# Altium schematic sheet MainSheet.SchDoc
size A3; SheetNumber: 1; SheetTotal: 1
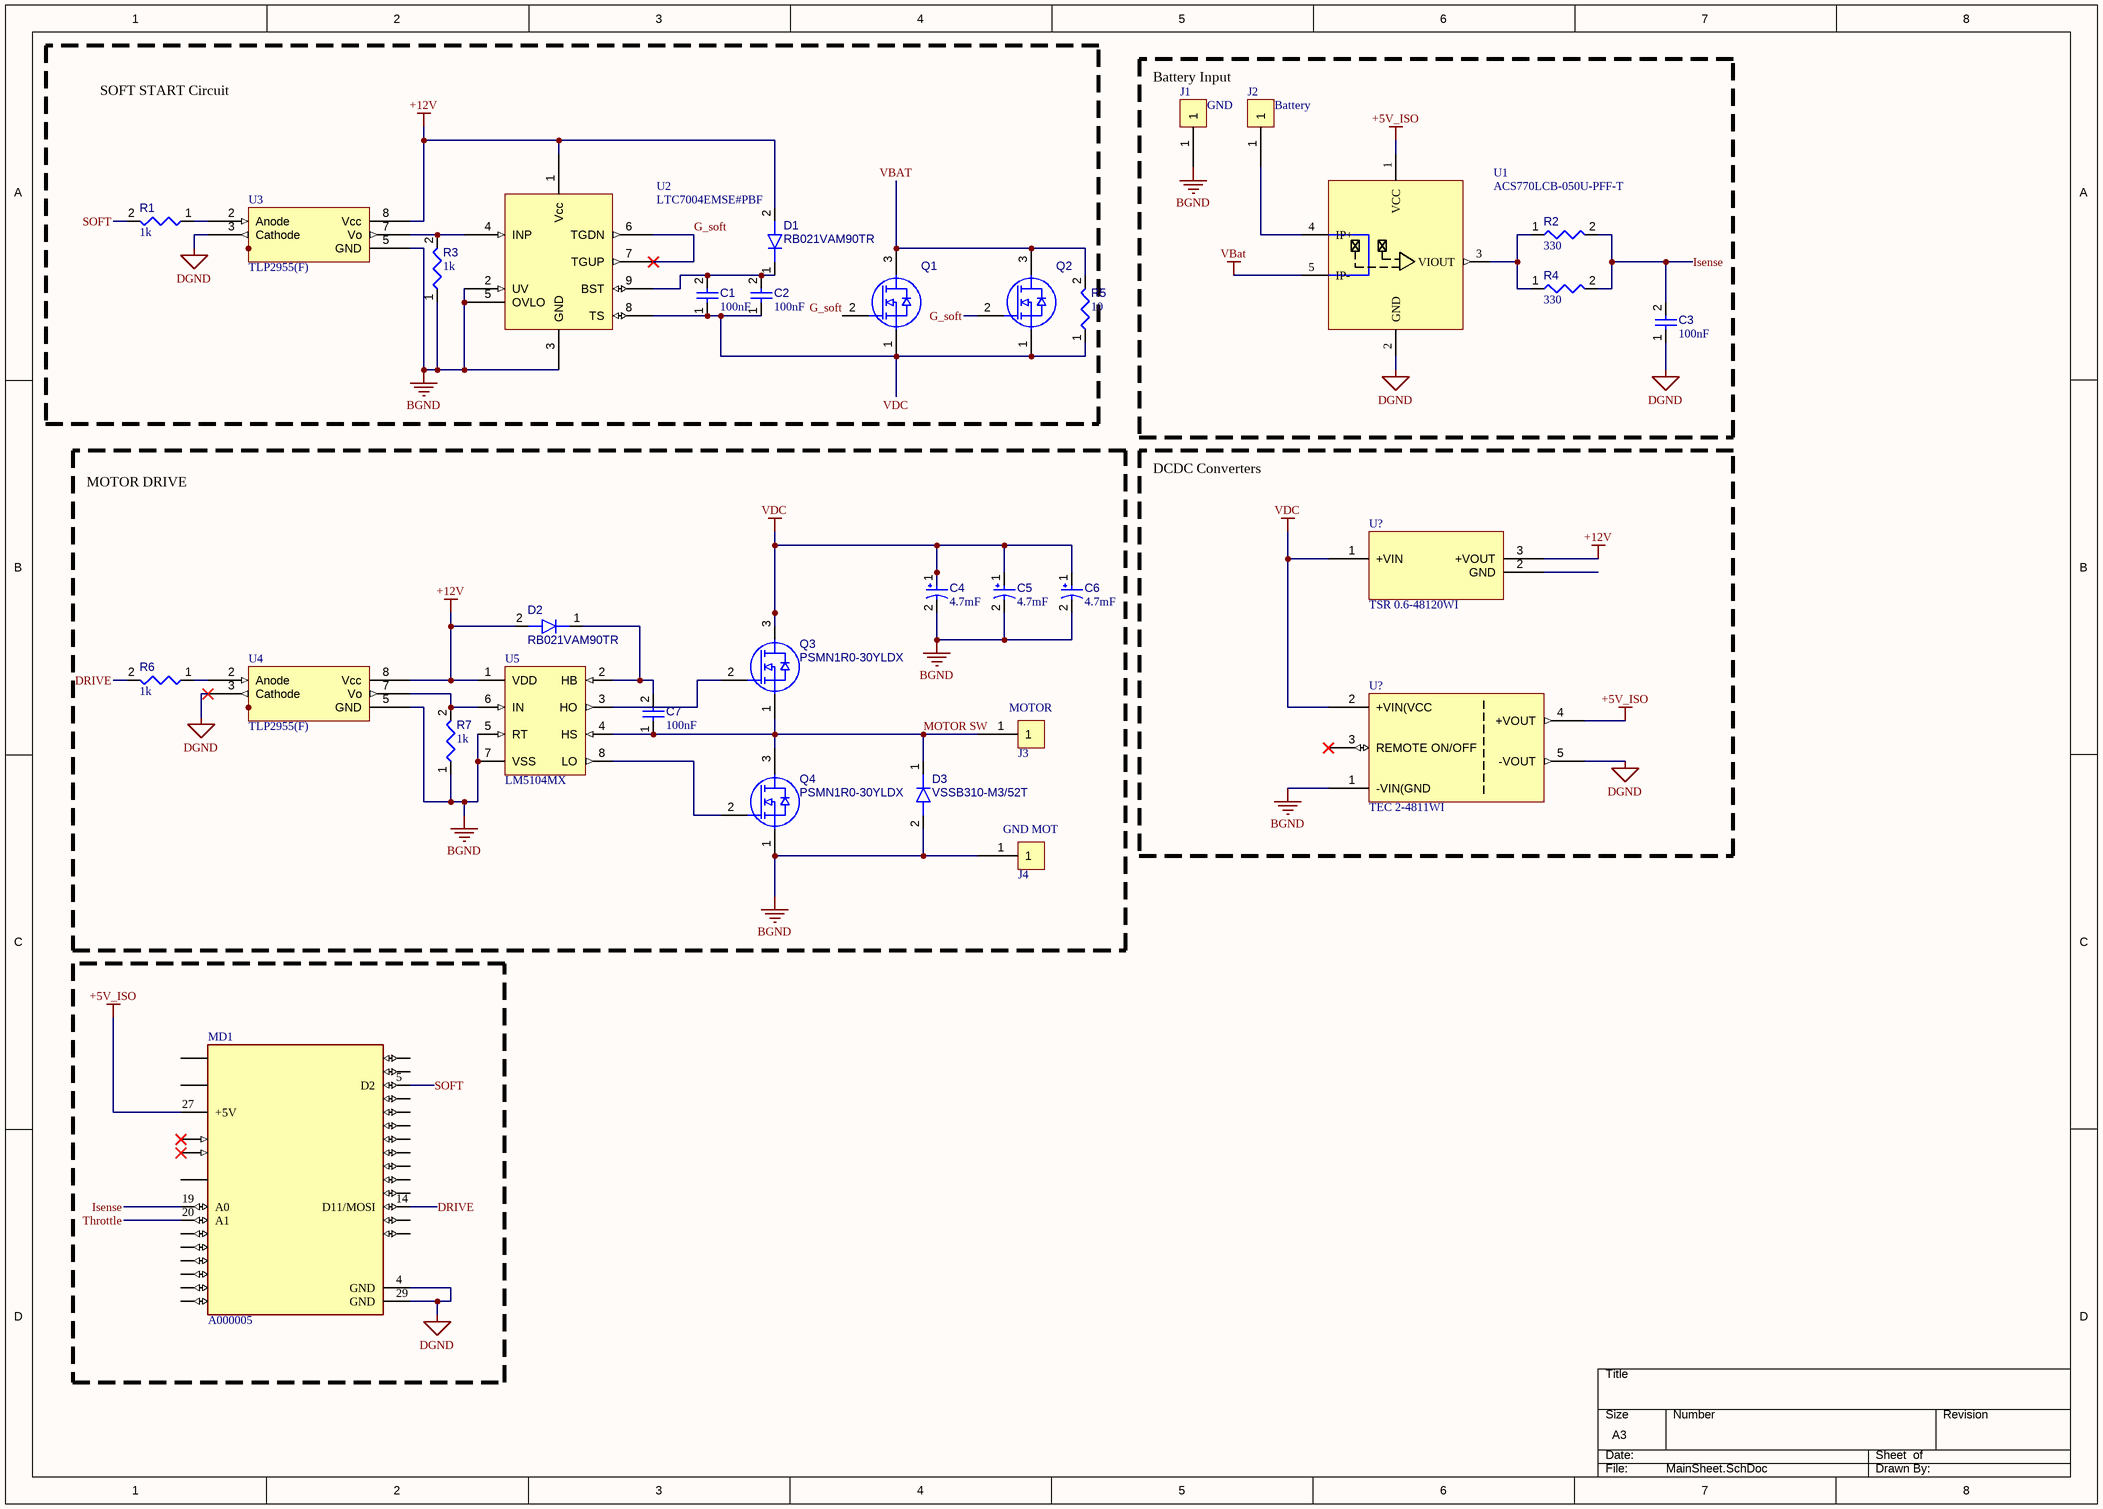
[diagram p0: MainSheet.SchDoc]

## Parts
(Parts that share a designator on the sheet are numbered #1, #2 ... from top to bottom, then left to right.)
C1  value 100nF  [CAPC3216X06N]  (hidden comment: C1206C104K1RACTU)
C2  value 100nF  [CAPC3216X06N]  (hidden comment: C1206C104K1RACTU)
C3  value 100nF  [CAPC3216X06N]  (hidden comment: C1206C104K1RACTU)
C4  value 4.7mF  [UVR1J472MRD-Footprint-1]  (hidden comment: UVR1J472MRD)
C5  value 4.7mF  [UVR1J472MRD-Footprint-1]  (hidden comment: UVR1J472MRD)
C6  value 4.7mF  [UVR1J472MRD-Footprint-1]  (hidden comment: UVR1J472MRD)
C7  value 100nF  [CAPC3216X06N]  (hidden comment: C1206C104K1RACTU)
D1  RB021VAM90TR  [DIOM2014X08N]
D2  RB021VAM90TR  [DIOM2014X08N]
D3  VSSB310-M3/52T  [DIOM4336X24N]
J1  GND  [Solder Pad]
J2  Battery  [Solder Pad]
J3  MOTOR  [Solder Pad]
J4  GND MOT  [Solder Pad]
MD1  A000005  [FP-A000005-MFG]
Q1  IPB014N06NATMA1  [INF-PG-TO263-7-1_M]  (value not drawn)
Q2  IPB014N06NATMA1  [INF-PG-TO263-7-1_M]  (value not drawn)
Q3  PSMN1R0-30YLDX  [NXP-SOT669_L]
Q4  PSMN1R0-30YLDX  [NXP-SOT669_L]
R1  value 1k  [RESC3215X06N]  (hidden comment: CRGP1206F1K0)
R2  value 330  [FP-CRGP1206-IPC_C]  (hidden comment: CRGP1206F330R)
R3  value 1k  [RESC3215X06N]  (hidden comment: CRGP1206F1K0)
R4  value 330  [FP-CRGP1206-IPC_C]  (hidden comment: CRGP1206F330R)
R5  value 10  [RS2B-10 OHM-5%-Footprint-1]  (hidden comment: RS2B-10 OHM-5%)
R6  value 1k  [RESC3215X06N]  (hidden comment: CRGP1206F1K0)
R7  value 1k  [RESC3215X06N]  (hidden comment: CRGP1206F1K0)
U1  ACS770LCB-050U-PFF-T  [FP-CB-5-PFF-MFG]
U2  LTC7004EMSE#PBF  [TSSOP50P490X110_HS-11N]
U3  TLP2955(F)  [SOJ254P890X365-8M]
U4  TLP2955(F)  [SOJ254P890X365-8M]
U5  LM5104MX  [M08A_N]
U?#1  TSR 0.6-48120WI  [TSR0P6-WI_TRP]
U?#2  TEC 2-4811WI  [TEC2_TRP]

## Blocks framed on the sheet
SOFT START Circuit: C1 C2 D1 Q1 Q2 R1 R3 R5 U2 U3
Battery Input: C3 J1 J2 R2 R4 U1
MOTOR DRIVE: C4-C7 D2 D3 J3 J4 Q3 Q4 R6 R7 U4 U5
DCDC Converters: U?#1 U?#2

## Nets
+5V_ISO: MD1.27(+5V) U1.1(VCC) U?#2.4(+VOUT)
+12V: D1.2(A) D2.2(A) U2.1(Vcc) U3.8(Vcc) U4.8(Vcc) U5.1(VDD) U?#1.3(+VOUT)
BGND: C4.2 C5.2 C6.2 D3.2(A) J1.1 J4.1 Q4.1(S) R3.1 R7.1 U2.2(UV) U2.3(GND) U2.5(OVLO) U3.5(GND) U4.5(GND) U5.5(RT) U5.7(VSS) U?#2.1(-VIN(GND)
DGND: C3.1 MD1.4(GND) MD1.29(GND) U1.2(GND) U3.3(Cathode) U4.3(Cathode) U?#2.5(-VOUT)
VBAT: Q1.3(D) Q2.3(D) R5.2 U1.5(IP-)
VDC: C1.1 C2.1 C4.1 C5.1 C6.1 Q1.1(S) Q2.1(S) Q3.3(D) R5.1 U2.8(TS) U?#1.1(+VIN) U?#2.2(+VIN(VCC)
DRIVE: MD1.14(D11/MOSI) R6.2
G_soft: Q2.2(G) U2.6(TGDN) U2.7(TGUP)
Isense: C3.2 MD1.19(A0) R2.2 R4.2
MOTOR SW: C7.1 D3.1(K) J3.1 Q3.1(S) Q4.3(D) U5.4(HS)
SOFT: MD1.5(D2) R1.2
Throttle: MD1.20(A1)
NetC1_2: C1.2 C2.2 D1.1(K) U2.9(BST)
NetC7_2: C7.2 D2.1(K) U5.2(HB)
NetJ2_1: J2.1 U1.4(IP+)
NetQ3_2: Q3.2(G) U5.3(HO)
NetQ4_2: Q4.2(G) U5.8(LO)
NetR1_1: R1.1 U3.2(Anode)
NetR2_1: R2.1 R4.1 U1.3(VIOUT)
NetR3_2: R3.2 U2.4(INP) U3.7(Vo)
NetR6_1: R6.1 U4.2(Anode)
NetR7_2: R7.2 U4.7(Vo) U5.6(IN)
NetU3_1: U3.1(NC) U3.4(NC) U3.6(NC)
NetU4_1: U4.1(NC) U4.4(NC) U4.6(NC)

Not connected (* = marked no-connect by the designer): MD1 1(D1/TX) 2(D0/RX) 3(~{RESET})* 6(D3) 7(D4) 8(D5) 9(D6) 10(D7) 11(D8) 12(D9) 13(D10) 15(D12/MISO) 16(D13/SCK) 17(+3V3) 18(AREF) 21(A2) 22(A3) 23(A4) 24(A5) 25(A6) 26(A7) 28(~{RESET})* 30(VIN); Q1 2(G); U?#1 2(GND); U?#2 3(REMOTE_ON/OFF)*

## Notes on the sheet
- Labels drawn without touching a wire or pin: G_soft
- THIS DOCUMENT AND THE DATA DISCLOSED HEREIN OR
- HEREWITH IS THE PROPERTY OF ALTIUM LIMITED AND MAY
- DWG NO:
- REVISION
- REV:
- DESCRIPTION
- DATE
- APPROVED
- BE FREELY DISTRIBUTED IN WHOLE. NO RIGHTS ARE
- RESERVED OR EXPRESS OR IMPLIED WARANTEE GIVEN.
- ENG:
- APPROVALS
- PROJECT
- DSN:
- CHK:
- REFERENCE DOCUMENTS
- PROJECT REVISION:
- TITLE
- DOCUMENT REVISION:
- DESIGN ITEM:
- BOM:
- FAB DWG:
- PCB DWG:
- ASSY DWG:
- SCALE:
- A3
- SIZE
- CAGE CODE
- FILE NAME
- DWG NO.
- SHEET
- OF
- REV

## Library data of the parts
C1-C3 C7 = CMP-001-00083-1: Ceramic Capacitor, Multilayer, Ceramic, 200V, 10% +Tol, 10% -Tol, X7R, 15% TC, 0.01uF, 1206; Voltage Rating: 100V; Case/Package: 1206; Pins: 2; Mounting Technology: Surface Mount; Min Operating Temperature: -55°C; Max Operating Temperature: 125°C; Tolerance: 10%
C4-C6 = CMP-001-00084-3: Radial Can ALUMINUM ELECTROLYTIC CAPACITOR UVR 63V 4700muF ±20% 0.866Dia 22.00mm; Ripple Current: 3.2A; Pins: 2; Mounting Technology: Through Hole; Tolerance: 20%; Case/Package: Radial; Max Operating Temperature: 85°C; Voltage Rating: 63V; Min Operating Temperature: -40°C
D1 D2 = CMP-004-00031-1: Rectifier Diode, Schottky, 1 Phase, 1 Element, 0.2A, 90V V(RRM), Silicon; Forward Current: 200mA; Mounting Technology: Surface Mount; Max Operating Temperature: 125°C
D3 = CMP-004-00032-1: Rectifier Diode, Schottky, 1 Phase, 1 Element, 1.9A, 100V V(RRM), Silicon, DO-214AA; Forward Voltage: 700mV; Max Operating Temperature: 150°C; Mounting Technology: Surface Mount; Min Operating Temperature: -40°C
J1-J4 = CMP-002-00071-1: Solder Pad for soldering wires to the board
MD1 = CMP-020-00023-1: ATmega328 Microcontroller Development Board 16MHz CPU 2KB RAM 1KB/32KB EEPROM/Flash; Min Supply Voltage: 7V; Interface: I2C, SPI, USB; Max Supply Voltage: 12V; Frequency: 16MHz
Q1 Q2 = CMP-00000-4: Power MOSFET, N Channel, 60 V, 180 A, 0.0012 ohm, TO-263 (D2PAK), Surface Mount; pin to pad: 1>2+3+5+6+7 2>1 3>8; Drain to Source Breakdown Voltage: 60V; Drain to Source Resistance: 1.4mΩ; Continuous Drain Current (ID): 34A; Max Power Dissipation: 214W; Gate to Source Voltage (Vgs): 20V; Case/Package: TO-263-7; Drain to Source Voltage (Vdss): 60V
Q3 Q4 = CMP-013-00029-6: N-channel Logic Level MOSFET, 30 V, 300 A, -55 to 175 degC, 5-Pin SOT669, RoHS, Tape and Reel; pin to pad: 1>1+2+3 2>4 3>5; Transistor Type: 1N-Channel; Vgs (Max): 20V; RoHS Compliant: True; Pins: 5
R1 R3 R6 R7 = CMP-009-00177-1: Res Thick Film 1206 1K Ohm 1% 0.5W(1/2W) ±100ppm/C Pad SMD T/R Automotive AEC-Q200; Voltage Rating: 200V; Max Operating Temperature: 155°C; Tolerance: 1%; Mounting Technology: Surface Mount; Min Operating Temperature: -55°C; Case/Package: 1206
R2 R4 = CMP-009-00181-1: Res Thick Film 1206 330 Ohm 1% 0.5W(1/2W) ±100ppm/°C Pad SMD T/R Automotive AEC-Q200; Voltage Rating: 200V; Tolerance: 1%; Case/Package: 1206; Min Operating Temperature: -55°C; Max Operating Temperature: 155°C; Mounting Technology: Surface Mount
R5 = CMP-009-00178-1: Fixed Resistor, Wire Wound, 3W, 10ohm, 5.4772V, 5% +/-Tol, 20ppm/Cel, Through Hole Mount; Power Dissipation: 3W; Min Operating Temperature: -65°C; Tolerance: 5%; Case/Package: Axial; Max Operating Temperature: 250°C
U1 = CMP-010-00024-1: 4.1 μs output rise time in response to step input current; Min Supply Voltage: 4.5V; Max Supply Voltage: 5.5V; Max Operating Temperature: 150°C; Min Operating Temperature: -40°C
U2 = CMP-00024-00007-2: RoHS Compliant PRODUCTION (Last Updated: 2weeks ago) MSOP IC Gate Driver; pin to pad: 3>3+11; Case/Package: MSOP; Pins: 10
U3 U4 = CMP-00026-00001-4: Optocoupler Logic-Out Totem-Pole DC-IN 1-CH 8-Pin PDIP; Min Operating Temperature: -40°C; Case/Package: DIP; Pins: 8; Max Operating Temperature: 125°C
U5 = CMP-00024-00006-3: MOSFET DRVR 1.8A 2-OUT Hi/Lo Side Full Brdg/Half Brdg Inv/Non-Inv 8-Pin SOIC N T/R; Nominal Supply Current: 3mA; Pins: 8; Mounting Technology: Surface Mount; Case/Package: SOIC; Max Operating Temperature: 125°C; Min Operating Temperature: -40°C
U?#1 = CMP-019-00049-2: DC-DC Regulated Power Supply Module, 1 Output, 7.2W, Hybrid; Max Supply Voltage: 72V; Min Operating Temperature: -40°C; Max Operating Temperature: 85°C
U?#2 = CMP-019-00050-2: DC/DC converter, 18-75 VDC, 2 W, 1 output, 5 VDC, 79 % efficiency, TEC 2-4811WI; pin to pad: 4>6 5>7; Max Supply Voltage: 75V; Min Operating Temperature: -40°C; Max Operating Temperature: 93°C